# EasyEDA Pro project 主控基板_正式.epro, schematic 主控基板_正式
Create Date: 2024-08-03; Page Name: P1; Project Name: 功放; Schematic Name: 主控基板_1; Update Date: 2024-08-03; Company: 嘉立创EDA; Page Size: A4; Version: V1.0
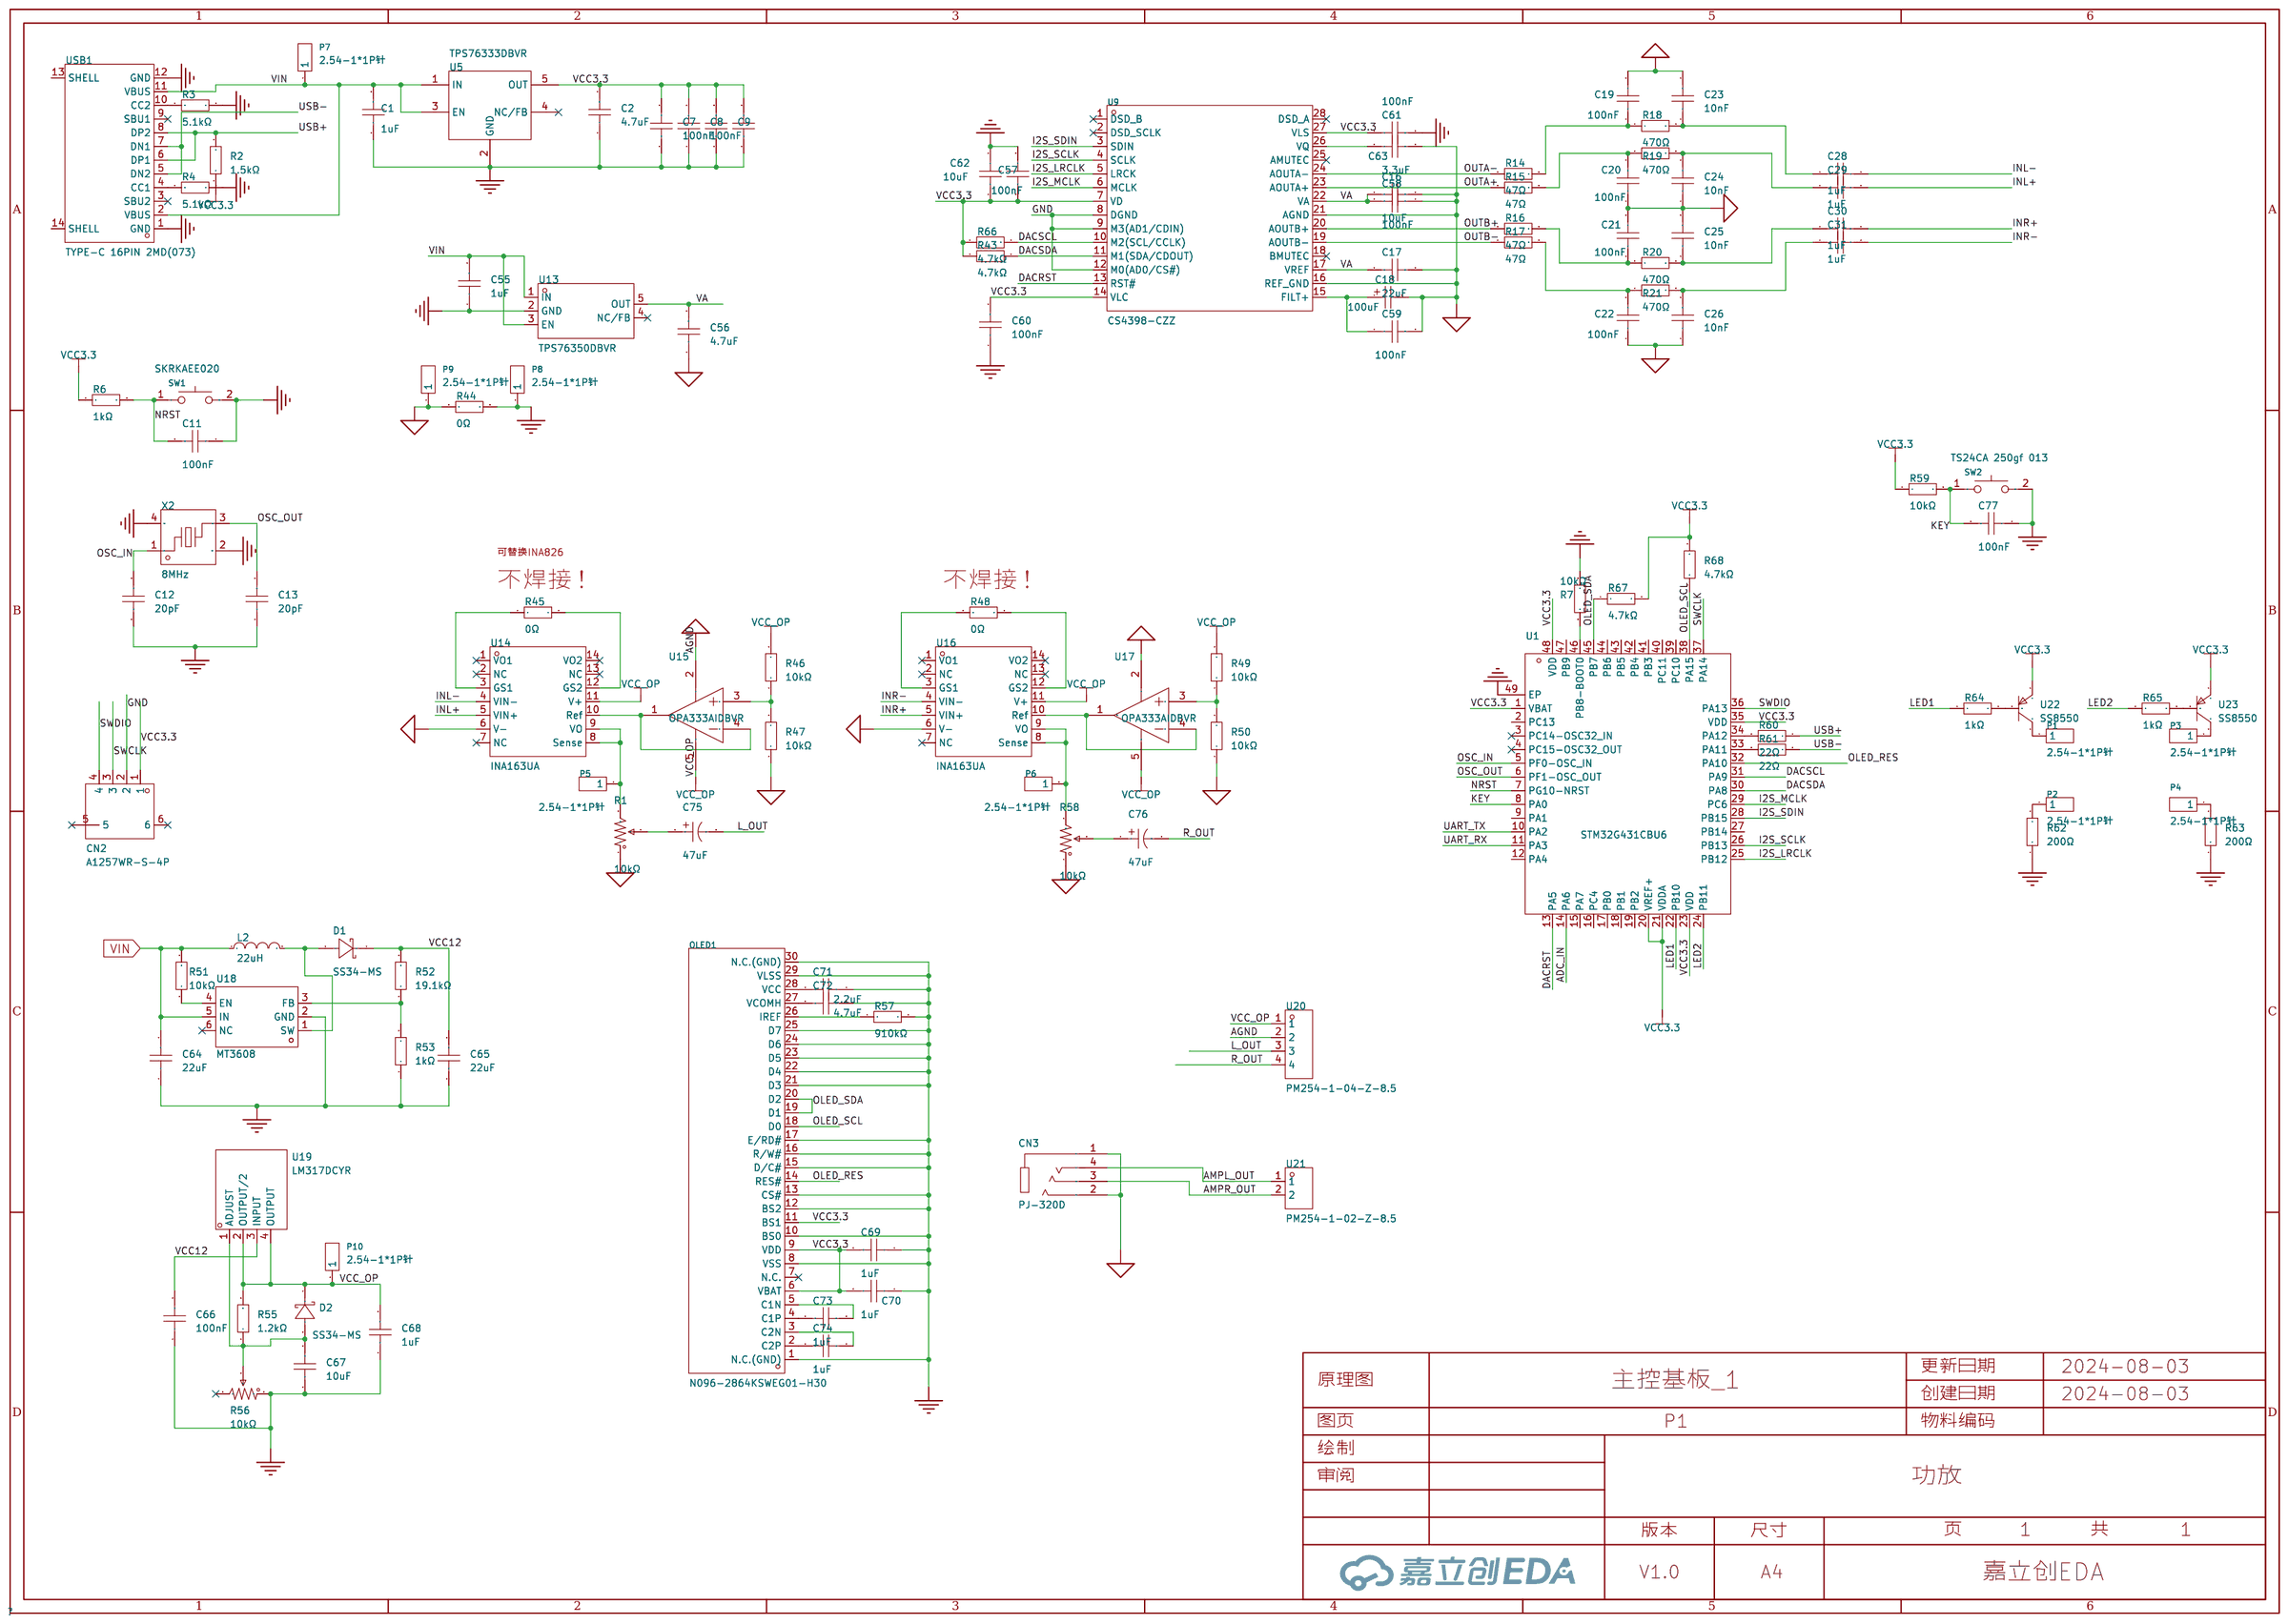
[diagram p0: schematic sheet]

## Parts
C1  1uF  [C0603]
C2  4.7uF  [C0603]
C7  100nF  [C0603]
C8  100nF  [C0603]
C9  100nF  [C0603]
C10  100nF  [C0603]
C11  100nF  [C0603]
C12  20pF  [C0603]
C13  20pF  [C0603]
C16  10uF  [C0603]
C17  22uF  [C0603]
C18  100uF  [CAP-SMD_L7.3-W4.3-R-RD]
C19  100nF  [C0603]
C20  100nF  [C0603]
C21  100nF  [C0603]
C22  100nF  [C0603]
C23  10nF  [C0603]
C24  10nF  [C0603]
C25  10nF  [C0603]
C26  10nF  [C0603]
C28  1uF  [C0603]
C29  1uF  [C0603]
C30  1uF  [C0603]
C31  1uF  [C0603]
C55  1uF  [C0603]
C56  4.7uF  [C0603]
C57  100nF  [C0603]
C58  100nF  [C0603]
C59  100nF  [C0603]
C60  100nF  [C0603]
C61  100nF  [C0603]
C62  10uF  [C0603]
C63  3.3uF  [C0603]
C64  22uF  [C0603]
C65  22uF  [C0603]
C66  100nF  [C0603]
C67  10uF  [C0603]
C68  1uF  [C0603]
C69  1uF  [C0603]
C70  1uF  [C0603]
C71  2.2uF  [C0603]
C72  4.7uF  [C0603]
C73  1uF  [C0603]
C74  1uF  [C0603]
C75  47uF  [CAP-SMD_BD5.0-L5.3-W5.3-LS6.0-FD]
C76  47uF  [CAP-SMD_BD5.0-L5.3-W5.3-LS6.0-FD]
C77  100nF  [C0603]
CN2  A1257WR-S-4P  [CONN-SMD_A1257WR-S-4P]
CN3  PJ-320D  [AUDIO-SMD_PJ-320D]
D1  SS34-MS  [DO-214AC_L4.3-W2.7-LS5.0-RD]
D2  SS34-MS  [DO-214AC_L4.3-W2.7-LS5.0-RD]
L2  22uH  [IND-SMD_L3.0-W3.0_FNR30XXS]
OLED1  N096-2864KSWEG01-H30  [OLED_0.96-30P-P0.70-12864]
P1  2.54-1*1P针  [HDR-TH_1P-P2.54-V-M]
P2  2.54-1*1P针  [HDR-TH_1P-P2.54-V-M]
P3  2.54-1*1P针  [HDR-TH_1P-P2.54-V-M]
P4  2.54-1*1P针  [HDR-TH_1P-P2.54-V-M]
P5  2.54-1*1P针  [HDR-TH_1P-P2.54-V-M]
P6  2.54-1*1P针  [HDR-TH_1P-P2.54-V-M]
P7  2.54-1*1P针  [HDR-TH_1P-P2.54-V-M]
P8  2.54-1*1P针  [HDR-TH_1P-P2.54-V-M]
P9  2.54-1*1P针  [HDR-TH_1P-P2.54-V-M]
P10  2.54-1*1P针  [HDR-TH_1P-P2.54-V-M]
R1  10kΩ  [RES-ADJ-SMD_3P-L3.0-W3.8-P1.75-BR]
R2  1.5kΩ  [R0603]
R3  5.1kΩ  [R0603]
R4  5.1kΩ  [R0603]
R6  1kΩ  [R0603]
R7  10kΩ  [R0603]
R14  47Ω  [R0603]
R15  47Ω  [R0603]
R16  47Ω  [R0603]
R17  47Ω  [R0603]
R18  470Ω  [R0603]
R19  470Ω  [R0603]
R20  470Ω  [R0603]
R21  470Ω  [R0603]
R43  4.7kΩ  [R0603]
R44  0Ω  [R0603]
R45  0Ω  [R0603]
R46  10kΩ  [R0603]
R47  10kΩ  [R0603]
R48  0Ω  [R0603]
R49  10kΩ  [R0603]
R50  10kΩ  [R0603]
R51  10kΩ  [R0603]
R52  19.1kΩ  [R0603]
R53  1kΩ  [R0603]
R55  1.2kΩ  [R0603]
R56  10kΩ  [RES-ADJ-SMD_3P-L3.0-W3.8-P1.75-BR]
R57  910kΩ  [R0603]
R58  10kΩ  [RES-ADJ-SMD_3P-L3.0-W3.8-P1.75-BR]
R59  10kΩ  [R0603]
R60  22Ω  [R0603]
R61  22Ω  [R0603]
R62  200Ω  [R0603]
R63  200Ω  [R0603]
R64  1kΩ  [R0603]
R65  1kΩ  [R0603]
R66  4.7kΩ  [R0603]
R67  4.7kΩ  [R0603]
R68  4.7kΩ  [R0603]
SW1  SKRKAEE020  [SW-SMD_L3.9-W3.0-P4.45]
SW2  TS24CA 250gf 013  [SW-SMD_L4.7-W3.5-P3.35-EH]
U1  STM32G431CBU6  [UFQFPN-48_L7.0-W7.0-P0.50-BL-EP]
U5  TPS76333DBVR  [SOT-23-5_L3.0-W1.7-P0.95-LS2.8-BR]
U9  CS4398-CZZ  [TSSOP-28_L9.7-W4.4-P0.65-LS6.4-BL]
U13  TPS76350DBVR  [SOT-23-5_L3.0-W1.7-P0.95-LS2.8-BR]
U14  INA163UA  [SOIC-14_L8.7-W3.9-P1.27-LS6.0-BL]
U15  OPA333AIDBVR  [SOT-23-5_L3.0-W1.7-P0.95-LS2.8-BR]
U16  INA163UA  [SOIC-14_L8.7-W3.9-P1.27-LS6.0-BL]
U17  OPA333AIDBVR  [SOT-23-5_L3.0-W1.7-P0.95-LS2.8-BR]
U18  MT3608  [SOT-23-6_L2.9-W1.6-P0.95-LS2.8-BL]
U19  LM317DCYR  [SOT-223-3_L6.5-W3.4-P2.30-LS7.0-BR]
U20  PM254-1-04-Z-8.5  [HDR-TH_4P-P2.54-V-F]
U21  PM254-1-02-Z-8.5  [HDR-TH_2P-P2.54-V-F]
U22  SS8550  [SOT-23-3_L2.9-W1.3-P1.90-LS2.4-BR]
U23  SS8550  [SOT-23-3_L2.9-W1.3-P1.90-LS2.4-BR]
USB1  TYPE-C 16PIN 2MD(073)  [USB-C-SMD_TYPE-C-6PIN-2MD-073]
X2  8MHz  [CRYSTAL-SMD_4P-L3.2-W2.5-BL]

## Library data of the parts
C1 C28-C31 C55 = CL10A105KO8NNNC: 容值:1uF;精度:±10%;额定电压:16V;材质(温度系数):X5R;; LCSC Part Name: 1uF ±10% 16V; Supplier Part: C1592; Manufacturer: SAMSUNG(三星); Supplier Footprint: 0603; JLCPCB Part Class: Extended Part; Datasheet: https://atta.szlcsc.com/upload/public/pdf/source/20220919/9FBE606BE0D9532D730F292EB26DC5BB.pdf; Supplier: LCSC; Tolerance: ±10%; Voltage Rated: 16V; Temperature Coefficient: X5R; Check: true
C2 C56 = CL10A475KO8NNNC: 容值:4.7uF;精度:±10%;额定电压:16V;材质(温度系数):X5R;; LCSC Part Name: 4.7uF ±10% 16V; Supplier Part: C19666; Manufacturer: SAMSUNG(三星); Supplier Footprint: 0603; JLCPCB Part Class: Basic Part; Datasheet: https://atta.szlcsc.com/upload/public/pdf/source/20160218/1457707763339.pdf; Supplier: LCSC; Tolerance: ±10%; Voltage Rated: 16V; Temperature Coefficient: X5R; Check: true
C7-C11 C19-C22 C57-C61 C77 = CC0603KRX7R9BB104: 容值:100nF;精度:±10%;额定电压:50V;材质(温度系数):X7R;; LCSC Part Name: 100nF ±10% 50V; Supplier Part: C14663; Manufacturer: YAGEO(国巨); Supplier Footprint: 0603; JLCPCB Part Class: Basic Part; Datasheet: https://atta.szlcsc.com/upload/public/pdf/source/20180910/C282072_33301C7F631E79921B82A8DAC6BCC5B3.pdf; Supplier: LCSC; Tolerance: ±10%; Voltage Rated: 50V; Temperature Coefficient: X7R; Check: true
C12 C13 = CC0603JRNPO9BN200: 容值:20pF;精度:±5%;额定电压:50V;材质(温度系数):NP0;; LCSC Part Name: 20pF ±5% 50V; Supplier Part: C105621; Manufacturer: YAGEO(国巨); Supplier Footprint: 0603; JLCPCB Part Class: Extended Part; Datasheet: https://atta.szlcsc.com/upload/public/pdf/source/20170505/1493957838062.pdf; Supplier: LCSC; Tolerance: ±5%; Voltage Rated: 50V; Temperature Coefficient: NP0
C16 C62 = CL10A106KP8NNNC: 容值:10uF;精度:±10%;额定电压:10V;材质(温度系数):X5R;; LCSC Part Name: 10uF ±10% 10V; Supplier Part: C19702; Manufacturer: SAMSUNG(三星); Supplier Footprint: 0603; JLCPCB Part Class: Basic Part; Datasheet: https://atta.szlcsc.com/upload/public/pdf/source/20160218/1457707763339.pdf; Supplier: LCSC; Tolerance: ±10%; Voltage Rated: 10V; Temperature Coefficient: X5R; Check: true
C17 = CL10A226MO7JZNC: 容值:22uF;精度:±20%;额定电压:16V;材质(温度系数):X5R;; LCSC Part Name: 22uF ±20% 16V; Supplier Part: C2762594; Manufacturer: SAMSUNG(三星); Supplier Footprint: 0603; JLCPCB Part Class: Extended Part; Datasheet: https://atta.szlcsc.com/upload/public/pdf/source/20220811/0832C3B1C642040B023B7A6186895861.pdf; Supplier: LCSC; Tolerance: ±20%; Voltage Rated: 16V; Temperature Coefficient: X5R; Check: true
C18 = CA45-D-16V-100μF-K: 容值:100uF;精度:±10%;额定电压:16V;等效串联电阻:200mΩ@100kHz;; LCSC Part Name: 100uF ±10% 16V; Supplier Part: C171666; Manufacturer: TORCH(火炬); Supplier Footprint: CASE-D-7343-28(mm); JLCPCB Part Class: Extended Part; Datasheet: https://atta.szlcsc.com/upload/public/pdf/source/20180207/C171666_15179894844561356210.pdf; Supplier: LCSC; Tolerance: ±10%; Rated Voltage: 16V; Equivalent Series Resistance(ESR): 200mΩ@100kHz; Operating Temperature: -55℃~+125℃; Voltage Rated: 6.3V; Temperature Coefficient: X5R; Check: true
C23-C26 = CC0603KRX7R9BB103: 容值:10nF;精度:±10%;额定电压:50V;材质(温度系数):X7R;; LCSC Part Name: 10nF ±10% 50V; Supplier Part: C100042; Manufacturer: YAGEO(国巨); Supplier Footprint: 0603; JLCPCB Part Class: Extended Part; Datasheet: https://atta.szlcsc.com/upload/public/pdf/source/20181008/C309510_22F155564471FAF6A489F7D68F34234E.pdf; Supplier: LCSC; Tolerance: ±10%; Voltage Rated: 50V; Temperature Coefficient: X7R; Check: true
C63 = C1608X5R1E335KT000E: 容值:3.3uF;精度:±10%;额定电压:25V;材质(温度系数):X5R;; LCSC Part Name: 3.3uF ±10% 25V; Supplier Part: C342962; Manufacturer: TDK; Supplier Footprint: 0603; JLCPCB Part Class: Extended Part; Datasheet: https://atta.szlcsc.com/upload/public/pdf/source/20190612/C361180_85CC9FB0751BEA97238DE56AB4AF0B1F.pdf; Supplier: LCSC; Tolerance: ±10%; Voltage Rated: 25V; Temperature Coefficient: X5R; Check: true
C64 C65 = CL10A226MO7JZNC: 容值:22uF;精度:±20%;额定电压:16V;材质(温度系数):X5R;; LCSC Part Name: 22uF ±20% 16V; Supplier Part: C2762594; Manufacturer: SAMSUNG(三星); Supplier Footprint: 0603; JLCPCB Part Class: Extended Part; Datasheet: https://atta.szlcsc.com/upload/public/pdf/source/20220811/0832C3B1C642040B023B7A6186895861.pdf; Supplier: LCSC; Tolerance: ±20%; Voltage Rated: 16V; Temperature Coefficient: X5R
C66 = CC0603KRX7R9BB104: 容值:100nF;精度:±10%;额定电压:50V;材质(温度系数):X7R;; LCSC Part Name: 100nF ±10% 50V; Supplier Part: C14663; Manufacturer: YAGEO(国巨); Supplier Footprint: 0603; JLCPCB Part Class: Basic Part; Datasheet: https://atta.szlcsc.com/upload/public/pdf/source/20180910/C282072_33301C7F631E79921B82A8DAC6BCC5B3.pdf; Supplier: LCSC; Tolerance: ±10%; Voltage Rated: 50V; Temperature Coefficient: X7R
C67 = CL10A106MA8NRNC: 容值:10uF;精度:±20%;额定电压:25V;材质(温度系数):X5R;; LCSC Part Name: 10uF ±20% 25V; Supplier Part: C96446; Manufacturer: SAMSUNG(三星); Supplier Footprint: 0603; JLCPCB Part Class: Basic Part; Datasheet: https://atta.szlcsc.com/upload/public/pdf/source/20160218/1457707763339.pdf; Supplier: LCSC; Tolerance: ±20%; Voltage Rated: 25V; Temperature Coefficient: X5R
C68-C70 C73 C74 = CL10A105KO8NNNC: 容值:1uF;精度:±10%;额定电压:16V;材质(温度系数):X5R;; LCSC Part Name: 1uF ±10% 16V; Supplier Part: C1592; Manufacturer: SAMSUNG(三星); Supplier Footprint: 0603; JLCPCB Part Class: Extended Part; Datasheet: https://atta.szlcsc.com/upload/public/pdf/source/20220919/9FBE606BE0D9532D730F292EB26DC5BB.pdf; Supplier: LCSC; Tolerance: ±10%; Voltage Rated: 16V; Temperature Coefficient: X5R
C71 = CL10A225KO8NNNC: 容值:2.2uF;精度:±10%;额定电压:16V;材质(温度系数):X5R;; LCSC Part Name: 2.2uF ±10% 16V; Supplier Part: C23630; Manufacturer: SAMSUNG(三星); Supplier Footprint: 0603; JLCPCB Part Class: Basic Part; Datasheet: https://atta.szlcsc.com/upload/public/pdf/source/20160218/1457707763339.pdf; Supplier: LCSC; Tolerance: ±10%; Voltage Rated: 16V; Temperature Coefficient: X5R
C72 = CL10A475KO8NNNC: 容值:4.7uF;精度:±10%;额定电压:16V;材质(温度系数):X5R;; LCSC Part Name: 4.7uF ±10% 16V; Supplier Part: C19666; Manufacturer: SAMSUNG(三星); Supplier Footprint: 0603; JLCPCB Part Class: Basic Part; Datasheet: https://atta.szlcsc.com/upload/public/pdf/source/20160218/1457707763339.pdf; Supplier: LCSC; Tolerance: ±10%; Voltage Rated: 16V; Temperature Coefficient: X5R
C75 C76 = RST47UF16V034: 容值:47uF;精度:±20%;额定电压:16V;纹波电流:31mA@120Hz;等效串联电阻:-;; LCSC Part Name: 47uF ±20% 16V; Supplier Part: C4747957; Manufacturer: KNSCHA(科尼盛); Supplier Footprint: SMD,D5xL5.4mm; JLCPCB Part Class: 扩展库; Datasheet: https://atta.szlcsc.com/upload/public/pdf/source/20220722/500705A6D89893C2D815A8D0726E5ECA.pdf; Supplier: LCSC; Tolerance: ±20%; Rated Voltage: 16V; Ripple Current: 31mA@120Hz; φD: 5mm; L: 5.4mm; Lifetime @ Temp: 2000hrs@105℃; Operating Temperature: -40℃~+105℃
CN2 = A1257WR-S-4P: 插针结构:1x4P;间距:1.25mm;安装方式:-;行距:-;总PIN数:4P;排数:1;每排PIN数:4;参考系列:GH;触头材质:黄铜;; LCSC Part Name: 1x4P 间距:1.25mm 系列:GH 镀锡; Supplier Part: C225127; Manufacturer: CJT(长江连接器); Supplier Footprint: SMD,P=1.25mm; JLCPCB Part Class: 扩展库; Datasheet: https://atta.szlcsc.com/upload/public/pdf/source/20181008/C272994_C9E89FA8A36D0009CAD30AD8C59C2782.pdf; Supplier: LCSC; Pins Structure: 1x4P; Pitch: 1.25mm; Number of Pins: 4P; Number of Rows: 1; Number of PINs Per Row: 4; Reference Series: GH; Contact Material: 黄铜
CN3 = PJ-320D_C431535: 连接器类型:3.5mm耳机座;额定电流:300mA;额定电压:50V;工作温度范围:-16℃~+65℃;; LCSC Part Name: 3.5mm耳机座; Supplier Part: C431535; Manufacturer: SHOU HAN(首韩); Supplier Footprint: SMD; JLCPCB Part Class: 扩展库; Datasheet: https://atta.szlcsc.com/upload/public/pdf/source/20190925/C431535_8B274506621F6117FB020BF07A197848.pdf; Supplier: LCSC; Connector Type: 3.5mm耳机座; Current Rating (Max): 300mA; Voltage Rating (Max): 50V; Operating Temperature Range: -16℃~+65℃
D1 D2 = SS34-MS: 二极管配置:-;正向压降(Vf):550mV@3A;直流反向耐压(Vr):40V;整流电流:3A;; LCSC Part Name: 电压:40V 电流:3A; Supplier Part: C2836396; Manufacturer: MSKSEMI(美森科); Supplier Footprint: SMA(DO-214AC); JLCPCB Part Class: 扩展库; Datasheet: https://atta.szlcsc.com/upload/public/pdf/source/20231010/B8429D209A8A83BAE11971393C9E7848.pdf; Supplier: LCSC; Forward Voltage (Vf@If): 550mV@3A; Reverse Voltage (Vr): 40V; Rectified Current: 3A; Reverse Leakage Current (Ir): 500uA@40V
L2 = FNR3015S220MT: 电感值:22uH;精度:±20%;额定电流:690mA;饱和电流(Isat):680mA;; LCSC Part Name: 22uH ±20% 680mA; Supplier Part: C167761; Manufacturer: cjiang(长江微电); Supplier Footprint: SMD,3x3x1.5mm; JLCPCB Part Class: 扩展库; Datasheet: https://atta.szlcsc.com/upload/public/pdf/source/20190327/C167925_9EFF0AABC4CA629C2CC95961DBF7D39D.pdf; Supplier: LCSC; Tolerance: ±20%; Rated Current: 690mA; Saturation Current (Isat): 680mA; DC Resistance (DCR): 598mΩ
OLED1 = N096-2864KSWEG01-H30: 主控芯片:SSD1306;尺寸(inch):0.96;; LCSC Part Name: 0.96寸 白色 128x64像素分辨率 单色 30PIN; Supplier Part: C2890596; Manufacturer: Newvision(新智景); JLCPCB Part Class: 扩展库; Supplier: LCSC; Main Control Chip: SSD1306; Size: 0.96
P1-P10 = 2.54-1*1P针: 插针结构:-;间距:-;行距:-;圆针/方针:-;安装类型:直插;排数:单排;总PIN位数:1P;额定电流:-;额定电压:-;配合针长度:-;塑高:-;触头材质:-;触头镀层:-;颜色:黑色;; LCSC Part Name: 直插; Supplier Part: C81276; Manufacturer: BOOMELE(博穆精密); Supplier Footprint: 插件,P=2.54mm; JLCPCB Part Class: 扩展库; Datasheet: https://atta.szlcsc.com/upload/public/pdf/source/20221018/3E9408392E35E6F57A28985E5F7BF5C9.pdf; Supplier: LCSC; Mounting Type: 直插; Number of Rows: 单排; Number of Pins: 1P; Color: 黑色
R1 R56 R58 = TC33X-2-103E: 阻值:10kΩ;精度:±25%;功率:150mW;温度系数:±250ppm/℃;; LCSC Part Name: 10kΩ ±25%; Supplier Part: C719176; Manufacturer: BOURNS; Supplier Footprint: SMD-3P,3.8x3.6mm; JLCPCB Part Class: 扩展库; Datasheet: https://atta.szlcsc.com/upload/public/pdf/source/20200810/C720646_BB66A75E654D5E1D30127FF45BCD3C26.pdf; Supplier: LCSC; Tolerance: ±25%; Power(Watts): 150mW; Temperature Coefficient: ±250ppm/℃; Turns: 1
R2 = FRC0603F1501TS: 电阻类型:厚膜电阻;阻值:1.5kΩ;精度:±1%;功率:100mW;最大工作电压:75V;温度系数:±100ppm/℃;; LCSC Part Name: 1.5kΩ ±1% 100mW 厚膜电阻; Supplier Part: C2930050; Manufacturer: FOJAN(富捷); Supplier Footprint: 0603; JLCPCB Part Class: Extended Part; Datasheet: https://atta.szlcsc.com/upload/public/pdf/source/20211221/925EC7D7225764EE0046F22065062C87.pdf; Supplier: LCSC; Type: 厚膜电阻; Tolerance: ±1%; Power(Watts): 100mW; Overload Voltage (Max): 75V; Temperature Coefficient: ±100ppm/℃; Operating Temperature Range: -55℃~+155℃; Check: true
R3 R4 = FRC0603F5101TS: 电阻类型:厚膜电阻;阻值:5.1kΩ;精度:±1%;功率:100mW;最大工作电压:75V;温度系数:±100ppm/℃;; LCSC Part Name: 5.1kΩ ±1% 100mW 厚膜电阻; Supplier Part: C2907044; Manufacturer: FOJAN(富捷); Supplier Footprint: 0603; JLCPCB Part Class: Extended Part; Datasheet: https://atta.szlcsc.com/upload/public/pdf/source/20211221/925EC7D7225764EE0046F22065062C87.pdf; Supplier: LCSC; Type: 厚膜电阻; Tolerance: ±1%; Power(Watts): 100mW; Overload Voltage (Max): 75V; Temperature Coefficient: ±100ppm/℃; Operating Temperature Range: -55℃~+155℃; Check: true
R6 R53 R64 R65 = 0603WAF1001T5E: 电阻类型:厚膜电阻;阻值:1kΩ;精度:±1%;功率:100mW;最大工作电压:75V;温度系数:±100ppm/℃;; LCSC Part Name: 1kΩ ±1% 100mW 厚膜电阻; Supplier Part: C21190; Manufacturer: UNI-ROYAL(厚声); Supplier Footprint: 0603; JLCPCB Part Class: Basic Part; Datasheet: https://atta.szlcsc.com/upload/public/pdf/source/20200306/C422600_1E6D84923E4A46A82E41ADD87F860B5C.pdf; Supplier: LCSC; Type: 厚膜电阻; Tolerance: ±1%; Power(Watts): 100mW; Overload Voltage (Max): 75V; Temperature Coefficient: ±100ppm/℃; Operating Temperature Range: -55℃~+155℃
R7 R46 R47 R49-R51 R59 = 0603WAF1002T5E: 电阻类型:厚膜电阻;阻值:10kΩ;精度:±1%;功率:100mW;最大工作电压:75V;温度系数:±100ppm/℃;; LCSC Part Name: 厚膜电阻 10kΩ ±1% 100mW; Supplier Part: C25804; Manufacturer: UNI-ROYAL(厚声); Supplier Footprint: 0603; JLCPCB Part Class: Basic Part; Datasheet: https://atta.szlcsc.com/upload/public/pdf/source/20200306/C422600_1E6D84923E4A46A82E41ADD87F860B5C.pdf; Supplier: LCSC; Type: 厚膜电阻; Tolerance: ±1%; Power(Watts): 100mW; Overload Voltage (Max): 75V; Temperature Coefficient: ±100ppm/℃; Operating Temperature Range: -55℃~+155℃
R14-R17 = 0603WAJ0470T5E: 电阻类型:厚膜电阻;阻值:47Ω;精度:±5%;功率:100mW;最大工作电压:75V;温度系数:±200ppm/℃;; LCSC Part Name: 47Ω ±5% 100mW 厚膜电阻; Supplier Part: C1211; Manufacturer: UNI-ROYAL(厚声); Supplier Footprint: 0603; JLCPCB Part Class: Extended Part; Datasheet: https://atta.szlcsc.com/upload/public/pdf/source/20200306/C422600_1E6D84923E4A46A82E41ADD87F860B5C.pdf; Supplier: LCSC; Type: 厚膜电阻; Tolerance: ±5%; Power(Watts): 100mW; Overload Voltage (Max): 75V; Temperature Coefficient: ±200ppm/℃; Operating Temperature Range: -55℃~+155℃; Check: true
R18-R21 = 0603WAJ0471T5E: 电阻类型:厚膜电阻;阻值:470Ω;精度:±5%;功率:100mW;最大工作电压:75V;温度系数:±100ppm/℃;; LCSC Part Name: 470Ω ±5% 100mW 厚膜电阻; Supplier Part: C25241; Manufacturer: UNI-ROYAL(厚声); Supplier Footprint: 0603; JLCPCB Part Class: Extended Part; Datasheet: https://atta.szlcsc.com/upload/public/pdf/source/20200306/C422600_1E6D84923E4A46A82E41ADD87F860B5C.pdf; Supplier: LCSC; Type: 厚膜电阻; Tolerance: ±5%; Power(Watts): 100mW; Overload Voltage (Max): 75V; Temperature Coefficient: ±100ppm/℃; Operating Temperature Range: -55℃~+155℃; Check: true
R43 R66-R68 = RC0603FR-074K7L: 电阻类型:厚膜电阻;阻值:4.7kΩ;精度:±1%;功率:100mW;最大工作电压:75V;温度系数:±100ppm/℃;; LCSC Part Name: 厚膜电阻 4.7kΩ ±1% 100mW; Supplier Part: C99782; Manufacturer: YAGEO(国巨); Supplier Footprint: 0603; JLCPCB Part Class: Extended Part; Datasheet: https://atta.szlcsc.com/upload/public/pdf/source/20180224/C181757_15194369480721363983.pdf; Supplier: LCSC; Type: 厚膜电阻; Tolerance: ±1%; Power(Watts): 100mW; Overload Voltage (Max): 75V; Temperature Coefficient: ±100ppm/℃; Operating Temperature Range: -55℃~+155℃; Check: true
R44 R45 R48 = 0603WAF0000T5E: 电阻类型:厚膜电阻;阻值:0Ω;精度:±1%;功率:100mW;最大工作电压:75V;; LCSC Part Name: 0Ω ±1% 100mW 厚膜电阻; Supplier Part: C21189; Manufacturer: UNI-ROYAL(厚声); Supplier Footprint: 0603; JLCPCB Part Class: Basic Part; Datasheet: https://atta.szlcsc.com/upload/public/pdf/source/20200306/C422600_1E6D84923E4A46A82E41ADD87F860B5C.pdf; Supplier: LCSC; Type: 厚膜电阻; Tolerance: ±1%; Power(Watts): 100mW; Overload Voltage (Max): 75V; Operating Temperature Range: -55℃~+155℃
R52 = 0603WAF1912T5E: 电阻类型:厚膜电阻;阻值:19.1kΩ;精度:±1%;功率:100mW;最大工作电压:75V;温度系数:±100ppm/℃;; LCSC Part Name: 19.1kΩ ±1% 100mW 厚膜电阻; Supplier Part: C22897; Manufacturer: UNI-ROYAL(厚声); Supplier Footprint: 0603; JLCPCB Part Class: Extended Part; Datasheet: https://atta.szlcsc.com/upload/public/pdf/source/20200306/C422600_1E6D84923E4A46A82E41ADD87F860B5C.pdf; Supplier: LCSC; Type: 厚膜电阻; Tolerance: ±1%; Power(Watts): 100mW; Overload Voltage (Max): 75V; Temperature Coefficient: ±100ppm/℃; Operating Temperature Range: -55℃~+155℃
R55 = 0603WAF1201T5E: 电阻类型:厚膜电阻;阻值:1.2kΩ;精度:±1%;功率:100mW;最大工作电压:75V;温度系数:±100ppm/℃;; LCSC Part Name: 1.2kΩ ±1% 100mW 厚膜电阻; Supplier Part: C22765; Manufacturer: UNI-ROYAL(厚声); Supplier Footprint: 0603; JLCPCB Part Class: Basic Part; Datasheet: https://atta.szlcsc.com/upload/public/pdf/source/20200306/C422600_1E6D84923E4A46A82E41ADD87F860B5C.pdf; Supplier: LCSC; Type: 厚膜电阻; Tolerance: ±1%; Power(Watts): 100mW; Overload Voltage (Max): 75V; Temperature Coefficient: ±100ppm/℃; Operating Temperature Range: -55℃~+155℃
R57 = 0603WAF9103T5E: 电阻类型:厚膜电阻;阻值:910kΩ;精度:±1%;功率:100mW;最大工作电压:75V;温度系数:±100ppm/℃;; LCSC Part Name: 910kΩ ±1% 100mW 厚膜电阻; Supplier Part: C23263; Manufacturer: UNI-ROYAL(厚声); Supplier Footprint: 0603; JLCPCB Part Class: Extended Part; Datasheet: https://atta.szlcsc.com/upload/public/pdf/source/20200306/C422600_1E6D84923E4A46A82E41ADD87F860B5C.pdf; Supplier: LCSC; Type: 厚膜电阻; Tolerance: ±1%; Power(Watts): 100mW; Overload Voltage (Max): 75V; Temperature Coefficient: ±100ppm/℃; Operating Temperature Range: -55℃~+155℃
R60 R61 = 0603WAF220JT5E: 电阻类型:厚膜电阻;阻值:22Ω;精度:±1%;功率:100mW;最大工作电压:75V;温度系数:±100ppm/℃;; LCSC Part Name: 22Ω ±1% 100mW 厚膜电阻; Supplier Part: C23345; Manufacturer: UNI-ROYAL(厚声); Supplier Footprint: 0603; JLCPCB Part Class: Basic Part; Datasheet: https://atta.szlcsc.com/upload/public/pdf/source/20200306/C422600_1E6D84923E4A46A82E41ADD87F860B5C.pdf; Supplier: LCSC; Type: 厚膜电阻; Tolerance: ±1%; Power(Watts): 100mW; Overload Voltage (Max): 75V; Temperature Coefficient: ±100ppm/℃; Operating Temperature Range: -55℃~+155℃
R62 R63 = 0603WAF2000T5E: 电阻类型:厚膜电阻;阻值:200Ω;精度:±1%;功率:100mW;最大工作电压:75V;温度系数:±100ppm/℃;; LCSC Part Name: 200Ω ±1% 100mW 厚膜电阻; Supplier Part: C8218; Manufacturer: UNI-ROYAL(厚声); Supplier Footprint: 0603; JLCPCB Part Class: Basic Part; Datasheet: https://atta.szlcsc.com/upload/public/pdf/source/20200306/C422600_1E6D84923E4A46A82E41ADD87F860B5C.pdf; Supplier: LCSC; Type: 厚膜电阻; Tolerance: ±1%; Power(Watts): 100mW; Overload Voltage (Max): 75V; Temperature Coefficient: ±100ppm/℃; Operating Temperature Range: -55℃~+155℃
SW1 = SKRKAEE020: 电路结构:单刀单掷;按钮形状:圆形按钮;安装方式:立贴;开关长度:3.9mm;开关宽度:2.9mm;开关高度:2mm;触点电流:50mA;额定电压(DC):12V;带灯:-;机械寿命:-;; LCSC Part Name: 3.9*2.9*2mm 立贴 轻触开关; Supplier Part: C115357; Manufacturer: ALPSALPINE(阿尔卑斯阿尔派); Supplier Footprint: SMD; JLCPCB Part Class: 扩展库; Datasheet: https://atta.szlcsc.com/upload/public/pdf/source/20170620/1497944814772.pdf; Supplier: LCSC; Circuit: 单刀单掷; Actuator Style: 圆形按钮; Mounting Style: 立贴; Switch Length: 3.9mm; Switch Width: 2.9mm; Switch Height: 2mm; Contact Current: 50mA; Voltage Rating (DC): 12V
SW2 = TS24CA 250gf 013: 电路结构:单刀单掷;按钮形状:矩形按钮;作用力:250gf;安装方式:卧贴;开关长度:4.55mm;开关宽度:1.8mm;开关高度:3.5mm;带支架:不带;触点电流:50mA;额定电压(AC):-;额定电压(DC):12V;额定功率:0.6W;绝缘电阻:100MΩ;带灯:无;机械寿命:3万次;; LCSC Part Name: 2*4*3.5mm半包小贝贝TS-018小侧按键m165蓝牙耳机开关 250gf; Supplier Part: C5373430; Manufacturer: SHOU HAN(首韩); Supplier Footprint: SMD; JLCPCB Part Class: Extended Part; Datasheet: https://atta.szlcsc.com/upload/public/pdf/source/20230321/913029B0FB0CD391AF5EFD51697D8EC4.pdf; Supplier: LCSC; Circuit: 单刀单掷; Actuator Style: 矩形按钮; Operating Force: 250gf; Mounting Style: 卧贴; Switch Length: 4.55mm; Switch Width: 1.8mm; Switch Height: 3.5mm; Strike Gundam: 不带; Contact Current: 50mA; Voltage Rating (DC): 12V; Power Rating: 0.6W; Insulation Resistance: 100MΩ; Actuator/Cap Color: 黑色; With Lamp: 无; Mechanical Life: 3万次; Operating Temperature: -40℃~+85℃
U1 = STM32G431CBU6: CPU内核:ARM-M系列;程序存储容量:128KB;RAM总容量:32KB;GPIO端口数量:42;工作电压范围:1.71V~3.6V;CPU最大主频:170MHz;程序存储器类型:FLASH;; Supplier Part: C529356; Manufacturer: ST(意法半导体); Supplier Footprint: UFQFPN-48(7x7); JLCPCB Part Class: 扩展库; Datasheet: https://atta.szlcsc.com/upload/public/pdf/source/20200511/C529354_7C66CF00837B904D0C15DCE45B69418C.pdf; Supplier: LCSC; CPU Core: ARM-M系列; Program Storage Size: 128KB; RAM Size: 32KB; GPIO Ports Number: 42; Operating Voltage Range: 1.71V~3.6V; CPU Maximum Speed: 170MHz; Program Memory Type: FLASH; Operating Temperature Range: -40℃~+85℃; ADC (Bit): 12bit; DAC (Bit): 12bit; Peripheral/Function: DMA；PWM; Watchdog: 有; Infrared Data Association: 有; Low-Voltage Detect: 有; Direct Memory Access: 有; Internal Oscillator: 有
U5 = TPS76333DBVR: 输出类型:固定;最大输入电压:10V;输出电流:150mA;输出电压（最小值/固定值）:3.3V;; Supplier Part: C7100; Manufacturer: TI(德州仪器); Supplier Footprint: SOT-23-5; JLCPCB Part Class: 扩展库; Datasheet: https://atta.szlcsc.com/upload/public/pdf/source/20140704/1457707103369.pdf; Supplier: LCSC; Output Type: 固定; Maximum Input Voltage: 10V; Output Voltage: 3.3V; MAX Output Current: 150mA; Power Supply Rejection Ratio (PSRR): 60dB@(1kHz); Dropout Voltage: 500mV@(150mA); standby current: 100uA; Operating Temperature: -40℃~+125℃; Output Polarity: 正极; Number of Outputs: 1
U9 = CS4398-CZZ: 接口类型:PCM；DSD;供电电压:3.1V~5.25V;分辨率(位):24;; LCSC Part Name: CS4398 CZZ; Supplier Part: C1520740; Manufacturer: Cirrus Logic(凌云); Supplier Footprint: TSSOP-28; JLCPCB Part Class: 扩展库; Datasheet: https://atta.szlcsc.com/upload/public/pdf/source/20240129/F30CA7C324AD075843E2FC008598955A.pdf; Supplier: LCSC; Interface Type: PCM；DSD; Supply Voltage: 3.1V~5.25V; Number of Channels: 2; Resolution: 24; Operating Temperature: -10℃~+70℃; Check: true
U13 = TPS76350DBVR: 输出类型:固定;最大输入电压:10V;输出电压:5V;最大输出电流:150mA;电源纹波抑制比(PSRR):60dB@(1kHz);输出极性:正极;; LCSC Part Name: 输入10V 输出5V 150mA; Supplier Part: C194609; Manufacturer: TI(德州仪器); Supplier Footprint: SOT-23-5; JLCPCB Part Class: 扩展库; Datasheet: https://www.ti.com/cn/lit/gpn/tps763; Supplier: LCSC; Output Type: 固定; Maximum Input Voltage: 10V; Output Voltage: 5V; MAX Output Current: 150mA; Power Supply Rejection Ratio (PSRR): 60dB@(1kHz); Dropout Voltage: 300mV@(150mA); standby current: 100uA; Operating Temperature: -40℃~+125℃; Output Polarity: 正极; Number of Outputs: 1
U14 U16 = INA163UA: 放大器数:单路;输入偏置电流(Ib):2uA;输入失调电压(Vos):50uV;增益带宽积(GBP):-;压摆率(SR):15V/us;带宽(-3db):800kHz;; Supplier Part: C2868965; Manufacturer: TI(德州仪器); Supplier Footprint: SOIC-14; JLCPCB Part Class: 扩展库; Datasheet: https://www.ti.com/cn/lit/gpn/ina163; Supplier: LCSC; Number of Circuits: 单路; Current - Input Bias(Ib): 2uA; Voltage - Input Offset(Vos): 50uV; Slew Rate(SR): 15V/us; -3db Bandwidth: 800kHz; Operating Temperature: -40℃~+85℃
U15 U17 = OPA333AIDBVR: 放大器数:单路;增益带宽积(GBP):350kHz;输入偏置电流(Ib):70pA;输入失调电压(Vos):2uV;压摆率(SR):0.16V/us;带宽(-3db):-;轨到轨:-;; Supplier Part: C30878; Manufacturer: TI(德州仪器); Supplier Footprint: SOT-23-5; JLCPCB Part Class: Extended Part; Datasheet: https://www.ti.com/cn/lit/gpn/opa333; Supplier: LCSC; Number of Circuits: 单路; Gain Bandwidth Product(GBP): 350kHz; Current - Input Bias(Ib): 70pA; Voltage - Input Offset(Vos): 2uV; Slew Rate(SR): 0.16V/us; Operating Temperature: -40℃~+125℃; Output Current: 8mA; Supply Current: 200uA
U18 = MT3608: 功能类型:升压型;输入电压:2V~24V;输出电压:28V;输出电流(最大值):-;; Supplier Part: C84817; Manufacturer: 西安航天民芯; Supplier Footprint: SOT-23-6; JLCPCB Part Class: 扩展库; Datasheet: https://atta.szlcsc.com/upload/public/pdf/source/20161110/1478743351706.pdf; Supplier: LCSC; Function: 升压型; Input Voltage: 2V~24V; Output Voltage: 28V; Switching Frequency: 1.2MHz; Number of Outputs: 1; Topology: 升压式; Switch tube (built-in/external): 内置
U19 = LM317DCYR_C51466: 输出类型:可调;最大输入电压:40V;输出电压:1.25V~37V;最大输出电流:1.5A;输出极性:正极;; LCSC Part Name: ADJ 输入40V 输出1.25V~37V 1.5A; Supplier Part: C51466; Manufacturer: TI(德州仪器); Supplier Footprint: SOT-223-3; JLCPCB Part Class: 扩展库; Datasheet: https://www.ti.com/cn/lit/gpn/lm317; Supplier: LCSC; Output Type: 可调; Maximum Input Voltage: 40V; Output Voltage: 1.25V~37V; MAX Output Current: 1.5A; Output Polarity: 正极; Number of Outputs: 1
U20 = PM254-1-04-Z-8.5_C2897367: 插孔结构:1x4P;间距:2.54mm;行距:-;圆孔/方孔:方孔;安装类型:直插;排数:单排;总孔位数:4P;额定电流:3A;额定电压:-;插孔方向:顶部;塑高:8.5mm;触头材质:铜合金;工作温度范围:-40℃~+105℃;焊接温度(最大值):260℃@5S;; LCSC Part Name: 1x4P 间距:2.54mm 直插; Supplier Part: C2897367; Manufacturer: HCTL(华灿天禄); Supplier Footprint: 插件,P=2.54mm; JLCPCB Part Class: 扩展库; Datasheet: https://atta.szlcsc.com/upload/public/pdf/source/20230609/534BE42964C679BDE98E061007C4ABD6.pdf; Supplier: LCSC; Holes Structure: 1x4P; Pitch: 2.54mm; Circular Hole / Square Hole: 方孔; Mounting Type: 直插; Number of Rows: 单排; Number of Holes: 4P; Current Rating (Max): 3A; Holes Direction: 顶部; Insulation Height: 8.5mm; Contact Material: 铜合金; Operating Temperature Range: -40℃~+105℃; Soldering Temperature(Max): 260℃@5S
U21 = PM254-1-02-Z-8.5: 插孔结构:1x2P;间距:2.54mm;行距:-;圆孔/方孔:方孔;安装类型:直插;排数:单排;总孔位数:2P;额定电流:3A;额定电压:-;插孔方向:顶部;塑高:8.5mm;触头材质:铜合金;工作温度范围:-40℃~+105℃;焊接温度(最大值):260℃@5S;; LCSC Part Name: 1x2P 间距:2.54mm 直插; Supplier Part: C2897365; Manufacturer: HCTL(华灿天禄); Supplier Footprint: 插件,P=2.54mm; JLCPCB Part Class: 扩展库; Datasheet: https://atta.szlcsc.com/upload/public/pdf/source/20230609/534BE42964C679BDE98E061007C4ABD6.pdf; Supplier: LCSC; Holes Structure: 1x2P; Pitch: 2.54mm; Circular Hole / Square Hole: 方孔; Mounting Type: 直插; Number of Rows: 单排; Number of Holes: 2P; Current Rating (Max): 3A; Holes Direction: 顶部; Insulation Height: 8.5mm; Contact Material: 铜合金; Operating Temperature Range: -40℃~+105℃; Soldering Temperature(Max): 260℃@5S
U22 U23 = SS8550_C7420371: 晶体管类型:PNP;集电极电流(Ic):1.5A;集射极击穿电压(Vceo):25V;功率(Pd):300mW;直流电流增益(hFE@Ic,Vce):120@100mA,1.0V;; LCSC Part Name: 耐压:25V 电流:1.5A PNP H档 200-350; Supplier Part: C7420371; Manufacturer: 宏迦橙; Supplier Footprint: SOT-23; JLCPCB Part Class: 扩展库; Datasheet: https://atta.szlcsc.com/upload/public/pdf/source/20231222/5BDA6DBF3A79C59009F81F0EEE6F8969.pdf; Supplier: LCSC; Transistor Type: PNP; Collector Current (Ic): 1.5A; Collector-Emitter Breakdown Voltage (Vceo): 25V; Power Dissipation (Pd): 300mW; DC Current Gain (hFE@Ic,Vce): 120@100mA,1.0V; Transition Frequency (fT): 100MHz; Collector Cut-Off Current (Icbo): 100nA; Collector-Emitter Saturation Voltage (VCE(sat)@Ic,Ib): 500mV@800mA,80mA; Operating Temperature: -55℃~+150℃
USB1 = TYPE-C 16PIN 2MD(073): 连接器类型:Type-C;标准:-;公母:母;端口数量:1;触点数量:16P;安装方式:卧贴;额定电流 - 电源:5A;工作温度范围:-25℃~+85℃;; LCSC Part Name: Type-C 母 卧贴 带定位柱 不锈钢外壳 2次模顶; Supplier Part: C2765186; Manufacturer: SHOU HAN(首韩); Supplier Footprint: SMD; JLCPCB Part Class: 扩展库; Datasheet: https://atta.szlcsc.com/upload/public/pdf/source/20211123/39B17C16241EAC15C5E277BDA434118E.pdf; Supplier: LCSC; Connector Type: Type-C; Gender: 母; Number of Ports: 1; Number of Contacts: 16P; Mounting Style: 卧贴; Current Rating - Power (Max): 5A; Operating Temperature Range: -25℃~+85℃
X2 = X32258MSB4SI: 晶振类型:贴片晶振;频率:8MHz;常温频差:±10ppm;外接负载电容:20pF;频率稳定度(全温):±20ppm;; LCSC Part Name: 8MHz ±10ppm 20pF; Supplier Part: C2682774; Manufacturer: YXC(扬兴晶振); Supplier Footprint: SMD3225-4P; JLCPCB Part Class: 扩展库; Datasheet: https://atta.szlcsc.com/upload/public/pdf/source/20240329/19D5F850207469550BEB00D7DFEDBC7A.pdf; Supplier: LCSC; Crystal Type: 贴片晶振; Normal temperature Frequency Tolerance: ±10ppm; External load capacitor: 20pF; Frequency Stability(Full temperature range): ±20ppm; Operating Temperature: -40℃~+85℃

## Nets
AGND: C16.2 C17.2 C18.2 C19.2 C20.1 C21.2 C22.1 C23.2 C24.1 C25.2 C26.1 C56.1 C58.1 C59.2 C63.2 CN3.1 CN3.2 P9.1 R1.1 R44.1 R47.1 R50.1 R58.1 U9.16(REF_GND) U9.21(AGND) U14.6(V-) U15.2(V-) U16.6(V-) U17.2(V-) U20.2
GND: C1.1 C2.1 C7.1 C8.1 C9.1 C10.1 C11.1 C12.1 C13.1 C55.1 C57.2 C60.1 C61.2 C62.2 C64.1 C65.1 C66.1 C67.1 C68.1 C69.1 C70.1 C71.1 C72.1 C77.1 CN2.2 OLED1.1(N.C.(GND)) OLED1.8(VSS) OLED1.10(BS0) OLED1.12(BS2) OLED1.13(CS#) OLED1.15(D/C#) OLED1.16(R/W#) OLED1.17(E/RD#) OLED1.21(D3) OLED1.22(D4) OLED1.23(D5) OLED1.24(D6) OLED1.25(D7) OLED1.29(VLSS) OLED1.30(N.C.(GND)) P8.1 R3.2 R4.2 R7.2 R44.2 R53.1 R56.1 R57.2 R62.1 R63.1 SW1.2 SW2.2 U1.49(EP) U5.2(GND) U9.8(DGND) U9.9(M3(AD1/CDIN)) U9.12(M0(AD0/CS#)) U13.2(GND) U18.2(GND) USB1.1(GND) USB1.12(GND) X2.2(GND) X2.4(GND)
VCC3.3: C2.2 C7.2 C8.2 C9.2 C10.2 C57.1 C60.2 C61.1 C62.1 C69.2 C70.2 CN2.1 OLED1.6(VBAT) OLED1.9(VDD) OLED1.11(BS1) R2.1 R6.1 R43.1 R59.1 R66.1 R67.2 R68.2 U1.1(VBAT) U1.20(VREF+) U1.21(VDDA) U1.23(VDD) U1.35(VDD) U1.48(VDD) U5.5(OUT) U9.7(VD) U9.14(VLC) U9.27(VLS) U22.2(E) U23.2(E)
VCC12: C65.2 C66.2 D1.1(A) R52.2 U19.3(INPUT)
VCC_OP: C68.2 D2.1(A) P10.1 R46.2 R49.2 R55.2 U14.11(V+) U15.5(V+) U16.11(V+) U17.5(V+) U19.2(OUTPUT/2) U19.4(OUTPUT) U20.1
VIN: C1.2 C55.2 C64.2 L2.1 P7.1 R51.2 U5.1(IN) U5.3(EN) U13.1(IN) U13.3(EN) U18.5(IN) USB1.2(VBUS) USB1.11(VBUS)
ADC_IN: U1.14(PA6)
AMPL_OUT: CN3.4 U21.1
AMPR_OUT: CN3.3 U21.2
DACRST: U1.13(PA5) U9.13(RST#)
DACSCL: R66.2 U1.31(PA9) U9.10(M2(SCL/CCLK))
DACSDA: R43.2 U1.30(PA8) U9.11(M1(SDA/CDOUT))
I2S_LRCLK: U1.25(PB12) U9.5(LRCK)
I2S_MCLK: U1.29(PC6) U9.6(MCLK)
I2S_SCLK: U1.26(PB13) U9.4(SCLK)
I2S_SDIN: U1.28(PB15) U9.3(SDIN)
INL+: C29.2 U14.5(VIN+)
INL-: C28.2 U14.4(VIN-)
INR+: C30.2 U16.5(VIN+)
INR-: C31.2 U16.4(VIN-)
KEY: C77.2 R59.2 SW2.1 U1.8(PA0)
L_OUT: C75.2 U20.3
LED1: R64.1 U1.22(PB10)
LED2: R65.1 U1.24(PB11)
NRST: C11.2 R6.2 SW1.1 U1.7(PG10-NRST)
OLED_RES: OLED1.14(RES#) U1.32(PA10)
OLED_SCL: OLED1.18(D0) R68.1 U1.38(PA15)
OLED_SDA: OLED1.19(D1) OLED1.20(D2) R67.1 U1.45(PB7)
OSC_IN: C12.2 U1.5(PF0-OSC_IN) X2.1
OSC_OUT: C13.2 U1.6(PF1-OSC_OUT) X2.3
OUTA+: R15.1 U9.23(AOUTA+)
OUTA-: R14.1 U9.24(AOUTA-)
OUTB+: R16.1 U9.20(AOUTB+)
OUTB-: R17.1 U9.19(AOUTB-)
R_OUT: C76.2 U20.4
SWCLK: CN2.3 U1.37(PA14)
SWDIO: CN2.4 U1.36(PA13)
UART_RX: U1.11(PA3)
UART_TX: U1.10(PA2)
USB+: R2.2 R60.1 USB1.6(DP1) USB1.8(DP2)
USB-: R61.1 USB1.5(DN2) USB1.7(DN1)
VA: C16.1 C17.1 C56.2 C58.2 U9.17(VREF) U9.22(VA) U13.5(OUT)
$1N1038: R3.1 USB1.10(CC2)
$1N1066: R4.1 USB1.4(CC1)
$1N1850: R7.1 U1.46(PB8-BOOT0)
$1N5259: C63.1 U9.26(VQ)
$1N5273: C19.1 R14.2 R18.1
$1N5274: C20.2 R15.2 R19.1
$1N5275: C22.2 R17.2 R21.1
$1N5276: C21.1 R16.2 R20.1
$1N5283: C23.1 C28.1 R18.2
$1N5284: C24.2 C29.1 R19.2
$1N5285: C26.2 C31.1 R21.2
$1N5286: C25.1 C30.1 R20.2
$1N5300: C18.1 C59.1 U9.15(FILT+)
$1N10371: R45.1 U14.3(GS1)
$1N10376: R45.2 U14.12(GS2)
$1N10420: U14.10(Ref) U15.1(OUT) U15.4(IN-)
$1N10554: R46.1 R47.2 U15.3(IN+)
$1N10899: R48.1 U16.3(GS1)
$1N10903: R48.2 U16.12(GS2)
$1N10917: U16.10(Ref) U17.1(OUT) U17.4(IN-)
$1N10922: R49.1 R50.2 U17.3(IN+)
$1N11289: R51.1 U18.4(EN)
$1N11420: D1.2(K) L2.2 U18.1(SW)
$1N11519: R52.1 R53.2 U18.3(FB)
$1N12080: C67.2 D2.2(K) R55.1 R56.2 U19.1(ADJUST)
$1N12830: C71.2 OLED1.28(VCC)
$1N12856: C72.2 OLED1.27(VCOMH)
$1N12948: C73.2 OLED1.4(C1P)
$1N12974: C74.2 OLED1.2(C2P)
$1N12978: C73.1 OLED1.5(C1N)
$1N12986: C74.1 OLED1.3(C2N)
$1N13016: OLED1.26(IREF) R57.1
$1N13586: C76.1 R58.2
$1N13588: C75.1 R1.2
$1N13592: P5.1 R1.3 U14.8(Sense) U14.9(VO)
$1N13598: P6.1 R58.3 U16.8(Sense) U16.9(VO)
$1N13854: R60.2 U1.34(PA12)
$1N13880: R61.2 U1.33(PA11)
$1N14454: R64.2 U22.1(B)
$1N14480: R65.2 U23.1(B)
$1N14547: P1.1 U22.3(C)
$1N14590: P2.1 R62.2
$1N14633: P3.1 U23.3(C)
$1N14676: P4.1 R63.2

Not connected (* = marked no-connect by the designer): CN2 5* 6*; OLED1 7(N.C.)*; R56 3*; U1 2(PC13) 3(PC14-OSC32_IN)* 4(PC15-OSC32_OUT)* 9(PA1) 12(PA4) 15(PA7) 16(PC4) 17(PB0) 18(PB1) 19(PB2) 27(PB14) 39(PC10) 40(PC11) 41(PB3) 42(PB4) 43(PB5) 44(PB6) 47(PB9); U5 4(NC/FB)*; U9 1(DSD_B)* 2(DSD_SCLK)* 18(BMUTEC)* 25(AMUTEC)* 28(DSD_A)*; U13 4(NC/FB)*; U14 1(VO1)* 2(NC)* 7(NC)* 13(NC)* 14(VO2)*; U16 1(VO1)* 2(NC)* 7(NC)* 13(NC)* 14(VO2)*; U18 6(NC)*; USB1 3(SBU2)* 9(SBU1)* 13(SHELL) 14(SHELL)

## Notes on the sheet
- 可替换INA826
- 不焊接！
- 不焊接！
